# Altium schematic sheet Ethernet_PHY.SchDoc
size A4; DocumentNumber: 3; SheetNumber: 3; SheetTotal: 7
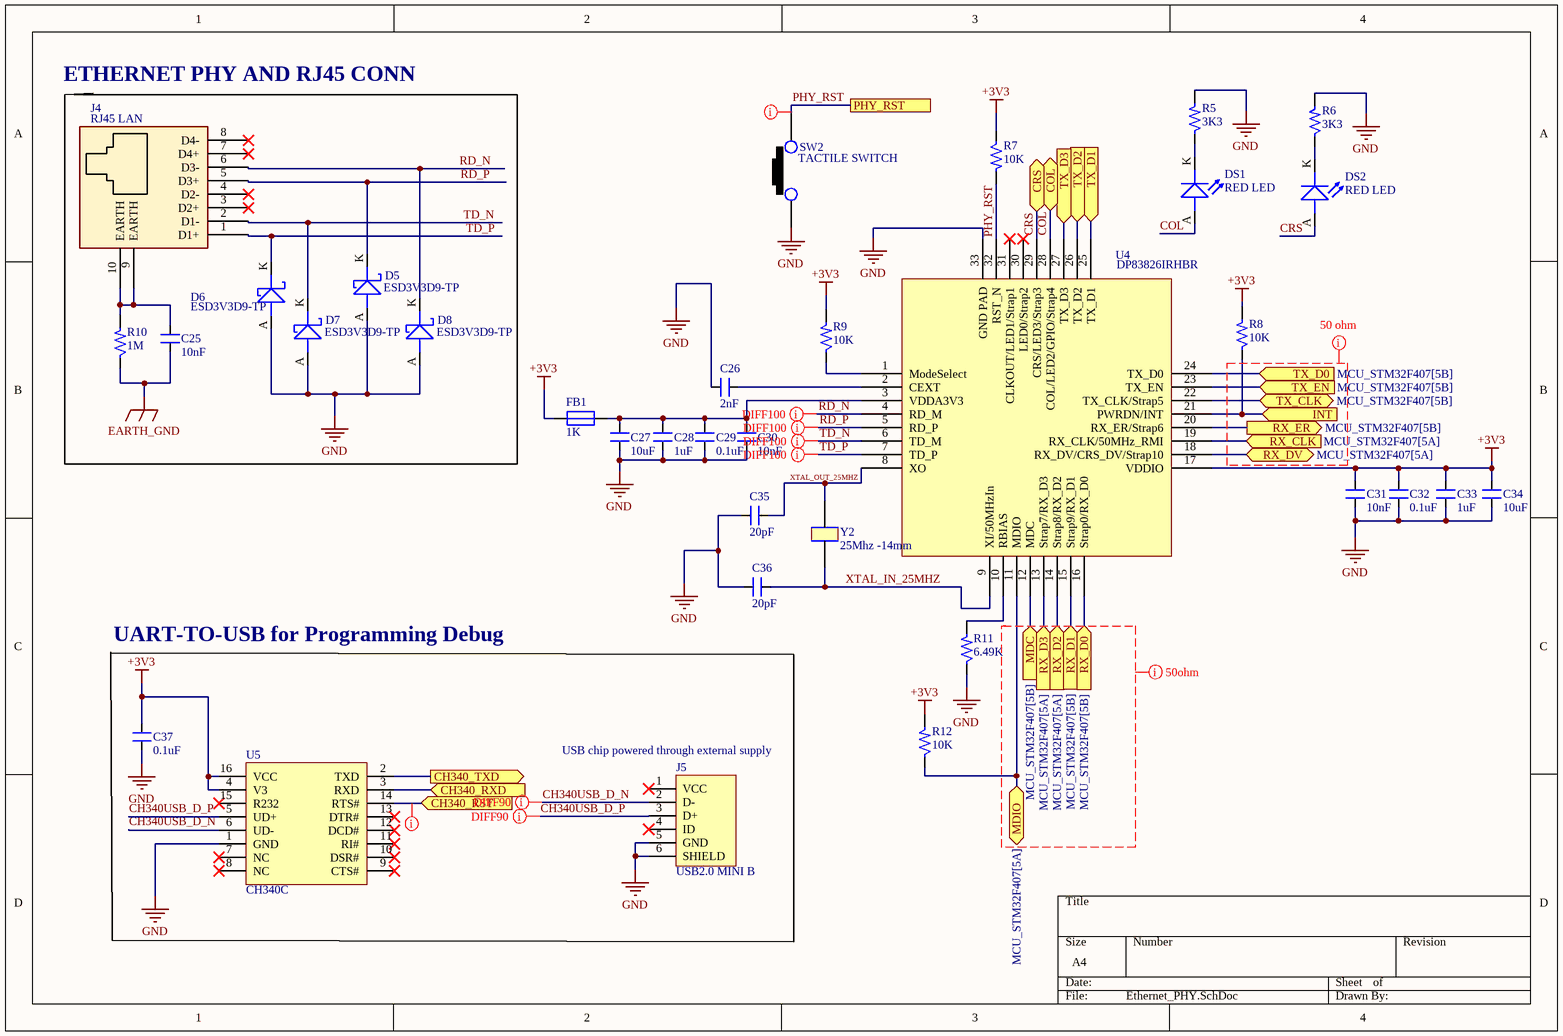
[diagram p0: Ethernet_PHY.SchDoc]

## Parts
C25  10nF  [CAP_P196_102X287_H332_RAD_TH]
C26  2nF  [CAP_0805]
C27  10uF  [CAP_1206]
C28  1uF  [CAP_0805]
C29  0.1uF  [CAP_0805]
C30  10nF  [CAP_0805]
C31  10nF  [CAP_0805]
C32  0.1uF  [CAP_0805]
C33  1uF  [CAP_0805]
C34  10uF  [CAP_1206]
C35  20pF  [CAP_0805]
C36  20pF  [CAP_0805]
C37  0.1uF  [CAP_0805]
D5  ESD3V3D9-TP  [DIO_SOD-923]
D6  ESD3V3D9-TP  [DIO_SOD-923]
D7  ESD3V3D9-TP  [DIO_SOD-923]
D8  ESD3V3D9-TP  [DIO_SOD-923]
DS1  RED LED  [LED_0805]
DS2  RED LED  [LED_0805]
FB1  1K  [IND_0805]
J4  RJ45 LAN  [CON10_P106_RJ45_TH_ST]
J5  USB2.0 MINI B  [CON_690-005-299-043]
R5  3K3  [RES_0603]
R6  3K3  [RES_0603]
R7  10K  [RES_0603]
R8  10K  [RES_0603]
R9  10K  [RES_0603]
R10  1M  [RES_1206]
R11  6.49K  [RES_0805]
R12  10K  [RES_0603]
SW2  TACTILE SWITCH  [SW_342_SMD]
U4  DP83826IRHBR  [VQFN32_19_218_23X9_SMD]
U5  CH340C  [SOIC16_50_284_25X90_SMT]
Y2  25Mhz -14mm  [XTAL_314_240X47_SMD]

## Blocks framed on the sheet
UART-TO-USB for Programming Debug: C37 J5 U5

## Ports
CH340_RST (in, see MCU_STM32F407[7B]), CH340_RXD (in, see MCU_STM32F407[5B]), CH340_TXD (out, see MCU_STM32F407[5B]), COL (bidir, see MCU_STM32F407[5A]), CRS (bidir, see MCU_STM32F407[5A]), INT (in), MDC (in, see MCU_STM32F407[5B]), MDIO (bidir, see MCU_STM32F407[5A]), PHY_RST (see MCU_STM32F407[5B]), RX_CLK (in, see MCU_STM32F407[5A]), RX_D0 (in, see MCU_STM32F407[5B]), RX_D1 (in, see MCU_STM32F407[5B]), RX_D2 (in, see MCU_STM32F407[5A]), RX_D3 (in, see MCU_STM32F407[5A]), RX_DV (bidir, see MCU_STM32F407[5A]), RX_ER (out, see MCU_STM32F407[5B]), TX_CLK (bidir, see MCU_STM32F407[5B]), TX_D0 (in, see MCU_STM32F407[5B]), TX_D1 (in, see MCU_STM32F407[5B]), TX_D2 (in, see MCU_STM32F407[5B]), TX_D3 (in, see MCU_STM32F407[7A]), TX_EN (in, see MCU_STM32F407[5B])

## Nets
+3V3: C31.2 C32.2 C33.2 C34.2 C37.2 FB1.1 R7.1 R8.2 R9.2 R12.2 U4.17(VDDIO) U5.4(V3) U5.16(VCC)
EARTH_GND: C25.1 R10.1
GND: C26.2 C27.1 C28.1 C29.1 C30.1 C31.1 C32.1 C33.1 C34.1 C35.1 C36.1 C37.1 D5.A D6.A D7.A D8.A J5.5(GND) J5.6(SHIELD) R5.2 R6.2 R11.1 SW2.1 U4.33(GND_PAD) U5.1(GND)
CH340_RST: U5.14(RTS#) ; port CH340_RST
CH340_RXD: U5.3(RXD) ; port CH340_RXD
CH340_TXD: U5.2(TXD) ; port CH340_TXD
CH340USB_D_N: J5.2(D-) U5.6(UD-)
CH340USB_D_P: J5.3(D+) U5.5(UD+)
COL: DS1.A(ANODE) U4.28(COL/LED2/GPIO/Strap4) ; port COL
CRS: DS2.A(ANODE) U4.29(CRS/LED3/Strap3) ; port CRS
INT: R8.1 U4.21(PWRDN/INT) ; port INT
MDC: U4.12(MDC) ; port MDC
MDIO: R12.1 U4.11(MDIO) ; port MDIO
PHY_RST: R7.2 SW2.2 U4.32(RST_N) ; port PHY_RST
RD_N: D8.K J4.6(D3-) U4.4(RD_M)
RD_P: D5.K J4.5(D3+) U4.5(RD_P)
RX_CLK: U4.19(RX_CLK/50MHz_RMI) ; port RX_CLK
RX_D0: U4.16(Strap0/RX_D0) ; port RX_D0
RX_D1: U4.15(Strap9/RX_D1) ; port RX_D1
RX_D2: U4.14(Strap8/RX_D2) ; port RX_D2
RX_D3: U4.13(Strap7/RX_D3) ; port RX_D3
RX_DV: U4.18(RX_DV/CRS_DV/Strap10) ; port RX_DV
RX_ER: U4.20(RX_ER/Strap6) ; port RX_ER
TD_N: D7.K J4.2(D1-) U4.6(TD_M)
TD_P: D6.K J4.1(D1+) U4.7(TD_P)
TX_CLK: U4.22(TX_CLK/Strap5) ; port TX_CLK
TX_D0: U4.24(TX_D0) ; port TX_D0
TX_D1: U4.25(TX_D1) ; port TX_D1
TX_D2: U4.26(TX_D2) ; port TX_D2
TX_D3: U4.27(TX_D3) ; port TX_D3
TX_EN: U4.23(TX_EN) ; port TX_EN
XTAL_IN_25MHZ: C36.2 U4.9(XI/50MHzIn) Y2.2
XTAL_OUT_25MHZ: C35.2 U4.8(XO) Y2.1
NetC25_2: C25.2 J4.9(EARTH) J4.10(EARTH) R10.2
NetC26_1: C26.1 U4.2(CEXT)
NetC27_2: C27.2 C28.2 C29.2 C30.2 FB1.2 U4.3(VDDA3V3)
NetDS1_K: DS1.K(CATHODE) R5.1
NetDS2_K: DS2.K(CATHODE) R6.1
NetR9_1: R9.1 U4.1(ModeSelect)
NetR11_2: R11.2 U4.10(RBIAS)

Not connected (* = marked no-connect by the designer): J4 3(D2+)* 4(D2-)* 7(D4+)* 8(D4-)*; J5 1(VCC)* 4(ID)*; U4 30(LED0/Strap2)* 31(CLKOUT/LED1/Strap1)*; U5 7(NC)* 8(NC)* 9(CTS#)* 10(DSR#)* 11(RI#)* 12(DCD#)* 13(DTR#)* 15(R232)*

## Layout directives
differential pair; differential pair class DIFF100: RD_N, RD_P, TD_N, TD_P
differential pair; differential pair class DIFF90: CH340USB_D_N, CH340USB_D_P
mark named 50ohm: (no net found under the mark)
mark named 50 ohm: (no net found under the mark)
net class Critical Nets: CH340_RST, PHY_RST

## Notes on the sheet
- (near J4) ETHERNET PHY AND RJ45 CONN
- (near J5) USB chip powered through external supply

## Library data of the parts
C25 = CAP_10nF-1KV-10%-RAD-TH: 10000pF ±10% 1000V (1kV) Ceramic Capacitor X7R Radial; Manufacturer: Yageo; Manufacturer Part Number: RDER73A103K2K1H03B; Alternate Part Number-1: NA; Case/Package: TH; Supplier-1: SP ROAD; Supplier Part Number-1: RDER73A103K2K1H03B
C26 = CAP_2nF-50V-10%-0805: 2000pF ±10% 50V Ceramic Capacitor X7R 0805 (2012 Metric); Manufacturer: Samsung Electro-Mechanics; Manufacturer Part Number: CL21B202KBANNNC; Alternate Part Number-1: NA; Case/Package: 0805; Supplier-1: Digikey; Supplier Part Number-1: 1276-2471-1-ND - Cut Tape (CT)
C27 C34 = CAP_10uF-50V-10%-1206: 10µF ±10% 50V Ceramic Capacitor X7R 1206 (3216 Metric); Manufacturer: KEMET; Manufacturer Part Number: CL31B106KBHNNNE; Alternate Part Number-1: GRT31CR61H106ME01L; Case/Package: 1206; Supplier-1: SIRICOM; Supplier Part Number-1: CC1206KKX5R9BB106
C28 C33 = CAP_1uF-50V-5%-0805: 1µF ±5% 50V Ceramic Capacitor X7R 0805 (2012 Metric); Manufacturer: Samsung; Manufacturer Part Number: CC0805JKX7R9BB105; Alternate Part Number-1: 0805F105M500NT; Case/Package: 0805; Supplier-1: SIRICOM; Supplier Part Number-1: CL21B105KBFNNNE
C29 C32 = CAP_0.1uF-50V-10%-0805: 0.1µF ±10% 50V Ceramic Capacitor X7R 0805 (2012 Metric); Manufacturer: Samsung; Manufacturer Part Number: CL21B104KBCNNNC; Alternate Part Number-1: NA; Case/Package: 0805; Supplier-1: SIRICOM; Supplier Part Number-1: 0805B104K500CT
C30 C31 = CAP_10nF-50V-10%-0805: 10000pF ±10% 50V Ceramic Capacitor X7R 0805 (2012 Metric); Manufacturer: Samsung; Manufacturer Part Number: C0805C103K5RECAUTO; Alternate Part Number-1: GRM2195C1H103JA01D; Case/Package: 0805; Supplier-1: SIRICOM; Supplier Part Number-1: 0805B103K500CT
C35 C36 = CAP_20pF-50V-10%-0805: ±10% 50V Ceramic Capacitor C0G, NP0 0805 (2012 Metric); Manufacturer: AVX Corporation; Manufacturer Part Number: 08055A200KAT2A; Alternate Part Number-1: NA; Case/Package: 0805; Supplier-1: Digikey; Supplier Part Number-1: 478-11887-1-ND - Cut Tape (CT)
C37 = CAP_0.1uF-50V-5%-0805: 0.1µF ±5% 50V Ceramic Capacitor X7R 0805 (2012 Metric); Manufacturer: AVX Corporation; Manufacturer Part Number: 08055C104JAT4A; Alternate Part Number-1: 0805B104M500; Case/Package: 0805; Supplier-1: SIRICOM; Supplier Part Number-1: 0805B104J500CT
D5-D8 = DIO-T_3.3V-8.8V-SOD923: 8.8V Clamp 5A (8/20µs) Ipp Tvs Diode Surface Mount SOD-923; Manufacturer: Micro Commercial Co; Alternate Part Number-1: NA; Manufacturer Part Number: ESD3V3D9-TP; Case/Package: SOD923; Supplier-1: Digikey; Supplier Part Number-1: ESD3V3D9-TPMSCT-ND - Cut Tape (CT)
DS1 DS2 = LED_RED-2V-20mA-0805: Red 631nm LED Indication - Discrete 2V 0805 (2012 Metric); Manufacturer: Vishay Lite-On; Manufacturer Part Number: LTST-C171KRKT; Alternate Part Number-1: NA; Case/Package: 0805; Supplier-1: SP ROAD; Supplier Part Number-1: LTST-C171KRKT
FB1 = FB_1K-100MHZ-1.6A-0805: 1 kOhms @ 100MHz 1 Power Line Ferrite Bead 0805 (2012 Metric) 1.6A; Manufacturer: Laird; Manufacturer Part Number: BLM21SP102SH1D; Alternate Part Number-1: NA; Case/Package: 0805; Supplier-1: SIRICOM; Supplier Part Number-1: ACMS201209A102
J4 = CON-SKT-RJ_8C8P-RA-TH: 8 Pins, 2 Row 2.54mm Pitch, right angle Connector, male; Manufacturer: Assmann; Manufacturer Part Number: A-2004-2-4-LPS-N-R; Alternate Part Number-1: NA; Case/Package: TH-CON; Supplier-1: SP ROAD; Supplier Part Number-1: A-2004-2-4-LPS-N-R
J5 = CON_USB2.0-MINIB-SMD: USB - mini B USB 2.0 Receptacle Connector 5 Position Surface Mount, Right Angle; Manufacturer: EDAC; Manufacturer Part Number: 690-005-299-043; Alternate Part Number-1: NA; Case/Package: USB-MINI-B; Supplier-1: LCSC; Supplier Part Number-1: C105424
R5 R6 = RES_3.3K-0.1W-1%-0603: 3.3 kOhms ±1% 0.1W, 1/10W Chip Resistor 0603 (1608 Metric) Automotive AEC-Q200 Thick Film; Manufacturer: Wilson; Manufacturer Part Number: WR06X3301FTL; Alternate Part Number-1: 0603WAF3301T5E; Case/Package: 0603; Supplier-1: SIRICOM; Supplier Part Number-1: WR06X3301FTL
R7-R9 R12 = RES_10K-0.1W-1%-0603: 10 kOhms ±1% 0.1W, 1/10W Chip Resistor 0603 (1608 Metric) Automotive AEC-Q200 Thick Film; Manufacturer: Walsin; Manufacturer Part Number: WR06X1002FTL; Alternate Part Number-1: 0603WAJ0103T5E; Case/Package: 0603; Supplier-1: SIRICOM; Supplier Part Number-1: WR06X1002FTL
R10 = RES_1M-0.25W-1%-1206: 1 MOhms ±1% 0.25W, 1/4W Chip Resistor 1206 (3216 Metric) Automotive AEC-Q200, High Voltage Thick Film; Manufacturer: Walsin; Manufacturer Part Number: WR12X1004FTL; Alternate Part Number-1: NA; Case/Package: 1206; Supplier-1: SIRICOM; Supplier Part Number-1: WR12X1004FTL
R11 = RES_6.49K-0.125W-1%-0805: 6.49 kOhms ±1% 0.125W, 1/8W Chip Resistor 0805 (2012 Metric) Moisture Resistant Thick Film; Manufacturer: Stackpole Electronics; Manufacturer Part Number: RC0805FR-076K49L; Alternate Part Number-1: NA; Case/Package: 0805; Supplier-1: SIRICOM; Supplier Part Number-1: WRO8X6491FTL
SW2 = SW1_RS-282G05A3-SMRT-SMD: Tactile Switch SPST-NO Top Actuated Surface Mount; Manufacturer: ITT C&K; Alternate Part Number-1: NA; Manufacturer Part Number: RS-282G05A3-SMRT; Case/Package: SMD; Supplier-1: SP ROAD; Supplier Part Number-1: RS-282G05A3-SMRT
U4 = IC_DP83826IRHBR: Ethernet ICs Low latency 10/100-Mbps PHY, MII interface and enhanced mode with an industrial temperature range 32-VQFN -40 to 85; Manufacturer: Texas Instruments; Alternate Part Number-1: NA; Manufacturer Part Number: DP83826IRHBR; Case/Package: 32-VQFN; Supplier-1: Mouser; Supplier Part Number-1: 595-DP83826IRHBR
U5 = IC_CH340C: USB Bridge, USB to UART USB 2.0 UART Interface; Manufacturer: Olimex; Alternate Part Number-1: NA; Manufacturer Part Number: CH340C; Case/Package: SOIC16; Supplier-1: LCSC; Supplier Part Number-1: C84681
Y2 = XTAL_25Mhz-FOXSDLF/250F-20: 25MHz ±30ppm Crystal 20pF 30 Ohms HC-49/US; Manufacturer: Abracon; Alternate Part Number-1: NA; Manufacturer Part Number: FOXSDLF/250F-20; Case/Package: SMD; Supplier-1: MOUSER; Supplier Part Number-1: FOXSDLF/250F-20